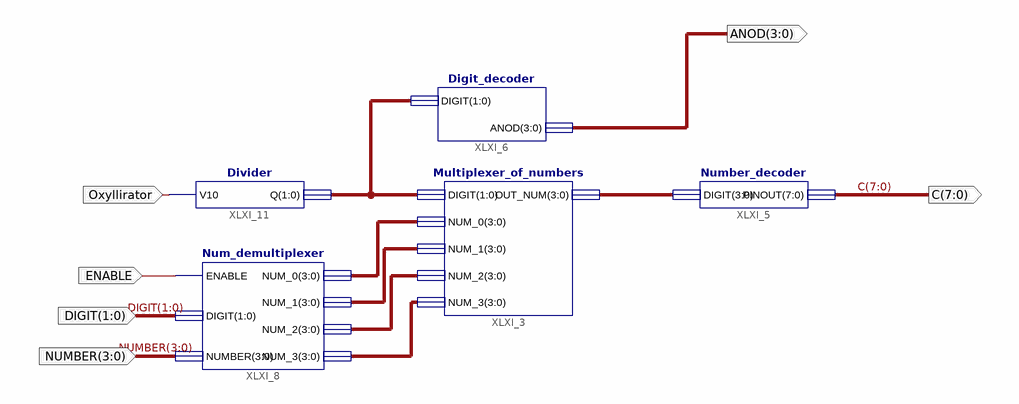
[diagram p0: schematic sheet 1]
// Xilinx ISE schematic Scheme.sch (spartan6) as structural Verilog: 5 symbols, 6 ports
module Scheme (
  input  Oxyllirator,
  input  [1:0] DIGIT,
  input  [3:0] NUMBER,
  input  ENABLE,
  output [3:0] ANOD,
  output [7:0] C
);

  wire [1:0] XLXN_1;
  wire [3:0] XLXN_2, XLXN_8, XLXN_11, XLXN_12, XLXN_28;

  Multiplexer_of_numbers XLXI_3 (
    .DIGIT(XLXN_1), .NUM_0(XLXN_8), .NUM_1(XLXN_12), .NUM_2(XLXN_28), .NUM_3(XLXN_11), .OUT_NUM(XLXN_2));
  Number_decoder XLXI_5 (.DIGIT(XLXN_2), .PINOUT(C));
  Digit_decoder XLXI_6 (.DIGIT(XLXN_1), .ANOD(ANOD));
  Num_demultiplexer XLXI_8 (
    .ENABLE(ENABLE), .DIGIT(DIGIT), .NUMBER(NUMBER), .NUM_0(XLXN_8), .NUM_1(XLXN_12), .NUM_2(XLXN_28),
    .NUM_3(XLXN_11));
  Divider XLXI_11 (.V10(Oxyllirator), .Q(XLXN_1));
endmodule
